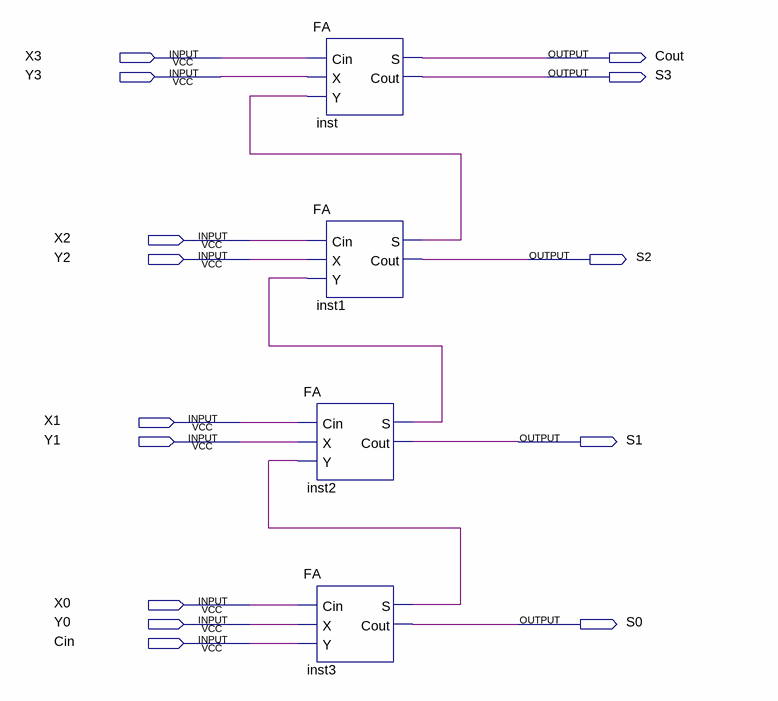
[diagram p0: schematic sheet]
// Quartus schematic Lab7step1.bdf as structural Verilog: 4 symbols, 14 pins
module Lab7step1 (
  input  X3,
  input  Y3,
  input  X2,
  input  Y2,
  input  X1,
  input  Y1,
  input  X0,
  input  Y0,
  input  Cin,
  output Cout,
  output S3,
  output S2,
  output S1,
  output S0
);

  wire inst1_s, inst2_s, inst3_s;

  FA inst (.Cin(X3), .X(Y3), .Y(inst1_s), .S(Cout), .Cout(S3));
  FA inst1 (.Cin(X2), .X(Y2), .Y(inst2_s), .S(inst1_s), .Cout(S2));
  FA inst2 (.Cin(X1), .X(Y1), .Y(inst3_s), .S(inst2_s), .Cout(S1));
  FA inst3 (.Cin(X0), .X(Y0), .Y(Cin), .S(inst3_s), .Cout(S0));
endmodule
